# Altium schematic sheet RXTX_IF_2.SchDoc
size A
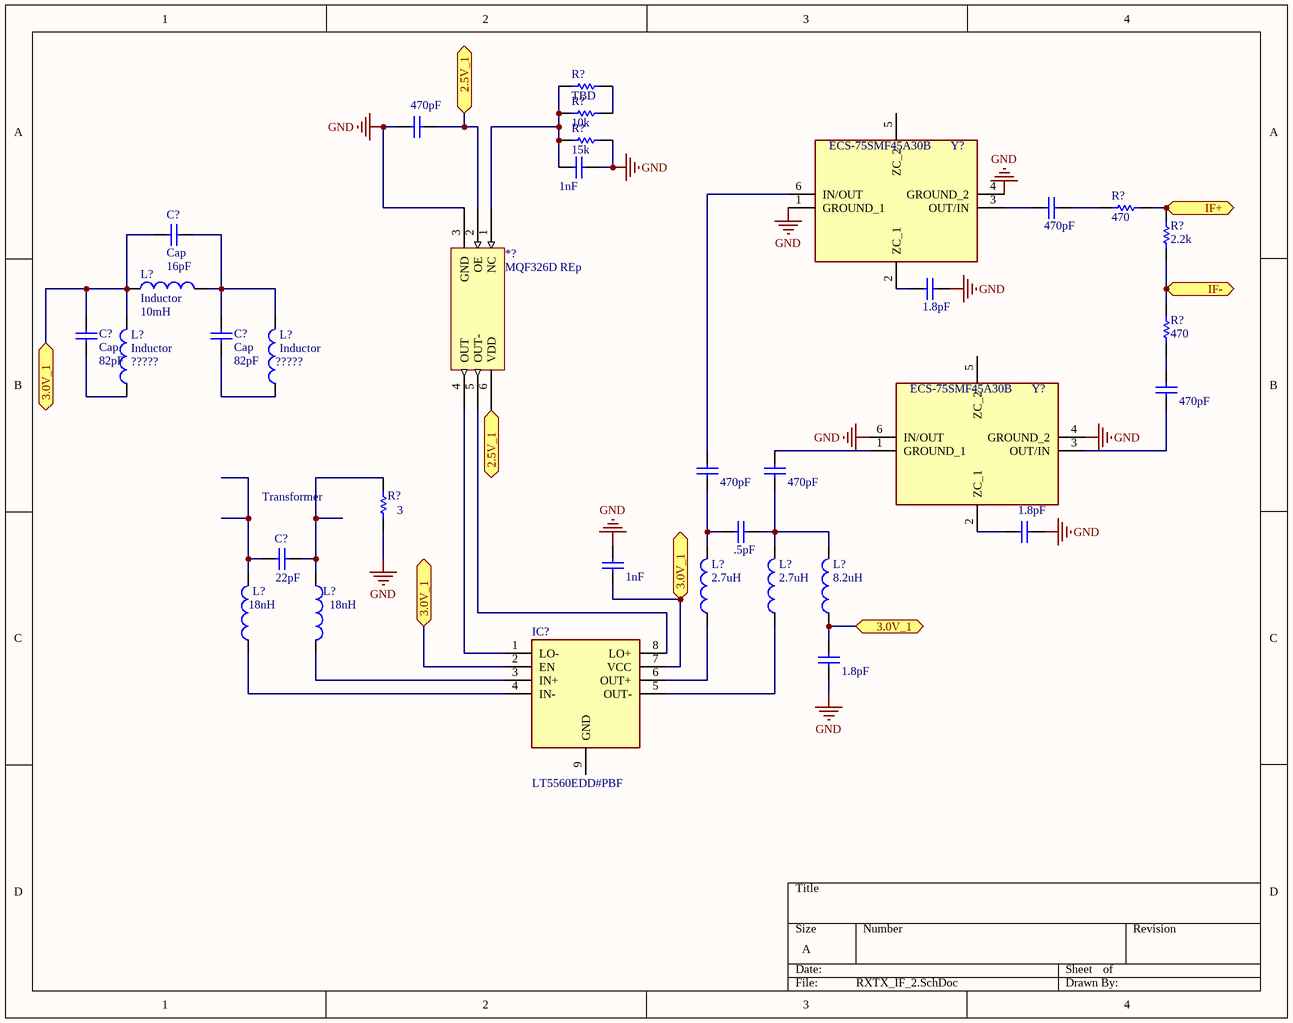
[diagram p0: RXTX_IF_2.SchDoc]

## Parts
(Parts that share a designator on the sheet are numbered #1, #2 ... from top to bottom, then left to right.)
*?  MQF326D REp  [MQF326D]
C?#1  value 470pF  [0603]  (hidden comment: Cap)
C?#2  value 1nF  [0603]  (hidden comment: Cap)
C?#3  value 470pF  [0603]  (hidden comment: Cap)
C?#4  Cap  value 16pF  [0603]
C?#5  value 1.8pF  [0603]  (hidden comment: Cap)
C?#6  Cap  value 82pF  [0603]
C?#7  Cap  value 82pF  [0603]
C?#8  value 470pF  [0603]  (hidden comment: Cap)
C?#9  value 470pF  [0603]  (hidden comment: Cap)
C?#10  value 470pF  [0603]  (hidden comment: Cap)
C?#11  value .5pF  [0603]  (hidden comment: Cap)
C?#12  value 1.8pF  [0603]  (hidden comment: Cap)
C?#13  value 1nF  [0603]  (hidden comment: Cap)
C?#14  value 22pF  [0603]  (hidden comment: Cap)
C?#15  value 1.8pF  [0603]  (hidden comment: Cap)
IC?  LT5560EDD#PBF  [SON50P300X300X80-9N-D]
L?#1  Inductor  value 10mH  [0603]
L?#2  Inductor  value ?????  [0603]
L?#3  Inductor  value ?????  [0603]
L?#4  value 18nH  [0603]  (hidden comment: Inductor)
L?#5  value 2.7uH  [0603]  (hidden comment: Inductor)
L?#6  value 2.7uH  [0603]  (hidden comment: Inductor)
L?#7  value 8.2uH  [0603]  (hidden comment: Inductor)
L?#8  value 18nH  [0603]  (hidden comment: Inductor)
R?#1  value TBD  [0603]  (hidden comment: Res1)
R?#2  value 10k  [0603]  (hidden comment: Res1)
R?#3  value 15k  [0603]  (hidden comment: Res1)
R?#4  value 470  [0603]  (hidden comment: Res1)
R?#5  value 2.2k  [0603]  (hidden comment: Res1)
R?#6  value 470  [0603]  (hidden comment: Res1)
R?#7  value 3  [0603]  (hidden comment: Res1)
Y?#1  ECS-75SMF45A30B  [ECS75SMF45A30B]
Y?#2  ECS-75SMF45A30B  [ECS75SMF45A30B]

## Ports
2.5V_1 (bidir), 3.0V_1 (bidir), IF+ (bidir), IF- (bidir)

## Nets
GND: *?.3(GND) C?#1.2 C?#2.1 C?#5.1 C?#12.1 C?#13.1 C?#15.1 R?#3.1 R?#7.1 Y?#1.1(GROUND_1) Y?#1.4(GROUND_2) Y?#2.4(GROUND_2) Y?#2.6(IN/OUT)
2.5V_1: *?.2(OE) *?.6(VDD) C?#1.1 ; port 2.5V_1
3.0V_1: C?#4.2 C?#6.1 C?#13.2 C?#15.2 IC?.2(EN) IC?.7(VCC) L?#1.1 L?#2.2 L?#7.1 ; port 3.0V_1
IF+: R?#4.1 R?#5.1 ; port IF+
IF-: R?#5.2 R?#6.1 ; port IF-
Net*?_1: *?.1(NC) C?#2.2 R?#1.2 R?#2.2 R?#3.2
Net*?_4: *?.4(OUT) IC?.1(LO-)
Net*?_5: *?.5(OUT-) IC?.8(LO+)
NetC?#3_1: C?#3.1 R?#4.2
NetC?#3_2: C?#3.2 Y?#1.3(OUT/IN)
NetC?#4_1: C?#4.1 C?#7.1 L?#1.2 L?#3.2
NetC?#5_2: C?#5.2 Y?#1.2(ZC_1)
NetC?#6_2: C?#6.2 L?#2.1
NetC?#7_2: C?#7.2 L?#3.1
NetC?#8_1: C?#8.1 Y?#2.3(OUT/IN)
NetC?#8_2: C?#8.2 R?#6.2
NetC?#9_1: C?#9.1 C?#11.2 L?#5.2
NetC?#9_2: C?#9.2 Y?#1.6(IN/OUT)
NetC?#10_1: C?#10.1 C?#11.1 L?#6.2 L?#7.2
NetC?#10_2: C?#10.2 Y?#2.1(GROUND_1)
NetC?#12_2: C?#12.2 Y?#2.2(ZC_1)
NetC?#14_1: C?#14.1 L?#4.1 R?#7.2
NetC?#14_2: C?#14.2 L?#8.2
NetIC?_3: IC?.3(IN+) L?#4.2
NetIC?_4: IC?.4(IN-) L?#8.1
NetIC?_5: IC?.5(OUT-) L?#6.1
NetIC?_6: IC?.6(OUT+) L?#5.1
NetR?#1_1: R?#1.1 R?#2.1

Not connected (* = marked no-connect by the designer): IC? 9(GND); Y?#1 5(ZC_2); Y?#2 5(ZC_2)

## Notes on the sheet
- Transformer

## Library data of the parts
*? = Component_1
C?#1-C?#15 = Cap: Capacitor; Published: 8-Jun-2000; LatestRevisionDate: 17-Jul-2002; LatestRevisionNote: Re-released for DXP Platform.; PackageReference: RAD-0.3; Publisher: Altium Limited; PackageDescription: Radial Cap, Thru-Hole; 2 Leads; 0.3 in Pin Spacing
IC? = LT5560EDD#PBF: Integrated Circuit; Manufacturer_Name: Linear Technology; Datasheet Link: https://www.analog.com/media/en/technical-documentation/data-sheets/5560f.pdf; Height: 0.8mm; Manufacturer_Part_Number: LT5560EDD#PBF; Mouser Part Number: 584-LT5560EDD#PBF; Mouser Price/Stock: https://www.mouser.com/Search/Refine.aspx?Keyword=584-LT5560EDD%23PBF; RS Part Number: 7869705; RS Price/Stock: https://uk.rs-online.com/web/p/products/7869705
L?#1-L?#8 = Inductor: Code_IEC: 1005; Published: 8-Jun-2000; LatestRevisionDate: 29-May-2009; LatestRevisionNote: IPC-7351 Footprint Added.; PackageReference: 0402-A; Publisher: Altium Limited; PackageDescription: Chip Inductor; Code_JEITA: 0402
R?#1-R?#7 = Res1: Resistor; Published: 8-Jun-2000; LatestRevisionDate: 17-Jul-2002; LatestRevisionNote: Re-released for DXP Platform.; PackageReference: AXIAL-0.3; Publisher: Altium Limited; PackageDescription: Axial Device, Thru-Hole; 2 Leads; 0.3 in Pin Spacing
Y?#1 Y?#2 = ECS-75SMF45A30B: Crystal or Oscillator; Manufacturer_Name: ECS; Datasheet Link: https://www.mouser.com/datasheet/2/122/ECS_75SMF-10007.pdf; Height: 0.95mm; Manufacturer_Part_Number: ECS-75SMF45A30B; Mouser Part Number: 520-ECS-75SMF45A30B; Mouser Price/Stock: https://www.mouser.com/Search/Refine.aspx?Keyword=520-ECS-75SMF45A30B